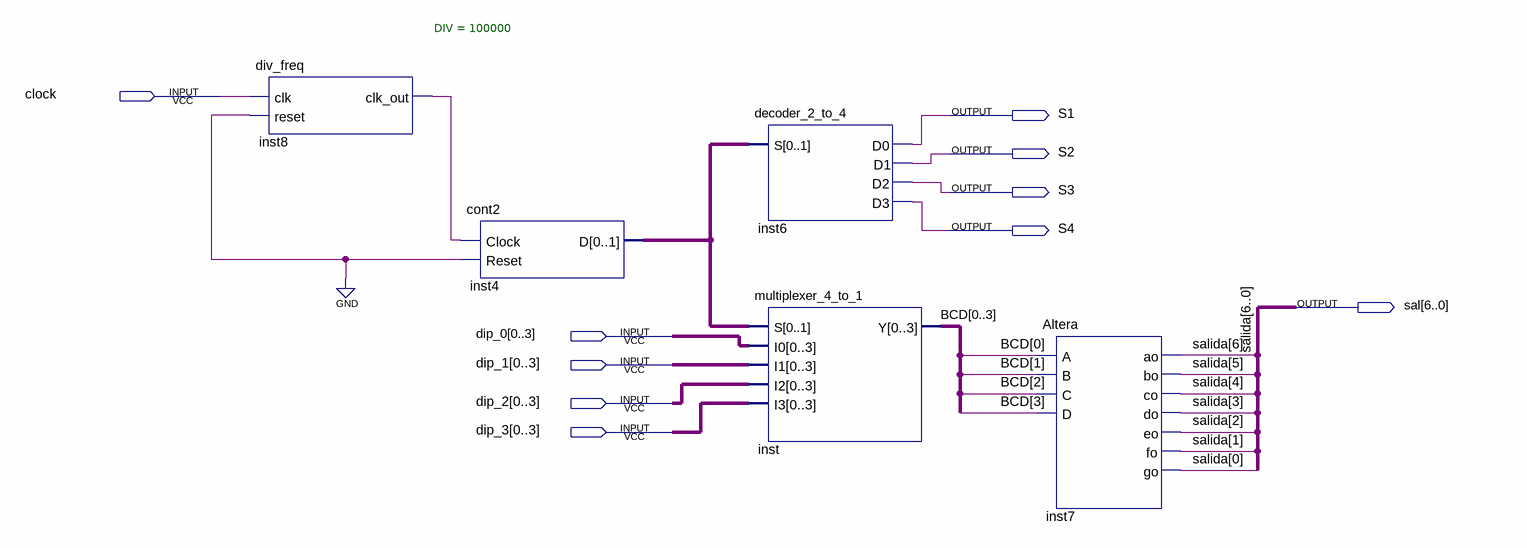
[diagram p0: schematic sheet]
// Quartus schematic Practica2.bdf as structural Verilog: 5 symbols, 10 pins
module Practica2 (
  input  clock,
  input  [0:3] dip_0,
  input  [0:3] dip_1,
  input  [0:3] dip_2,
  input  [0:3] dip_3,
  output S1,
  output S2,
  output S3,
  output S4,
  output [6:0] sal
);

  wire inst8_clk_out;
  wire [1:0] inst4_d;
  wire [3:0] BCD;

  div_freq #(.DIV(100000)) inst8 (.clk(clock), .reset(1'b0), .clk_out(inst8_clk_out));
  cont2 inst4 (.Clock(inst8_clk_out), .Reset(1'b0), .D(inst4_d));
  decoder_2_to_4 inst6 (.S(inst4_d), .D0(S1), .D1(S2), .D2(S3), .D3(S4));
  multiplexer_4_to_1 inst (
    .S(inst4_d), .I0(dip_0), .I1(dip_1), .I2(dip_2), .I3(dip_3), .Y({BCD[0], BCD[1], BCD[2], BCD[3]}));
  Altera inst7 (
    .A(BCD[0]), .B(BCD[1]), .C(BCD[2]), .D(BCD[3]), .ao(sal[6]), .bo(sal[5]), .co(sal[4]), .\do (sal[3]),
    .eo(sal[2]), .fo(sal[1]), .go(sal[0]));

  // Other names for the same wires on the sheet: salida[6:0] = sal
endmodule
